# Altium schematic sheet DC-DC.SchDoc
size A4; SPICEModelCacheLJJBMKMV: <root> / <DocumentId>LJJBMKMV</DocumentId> / </root>
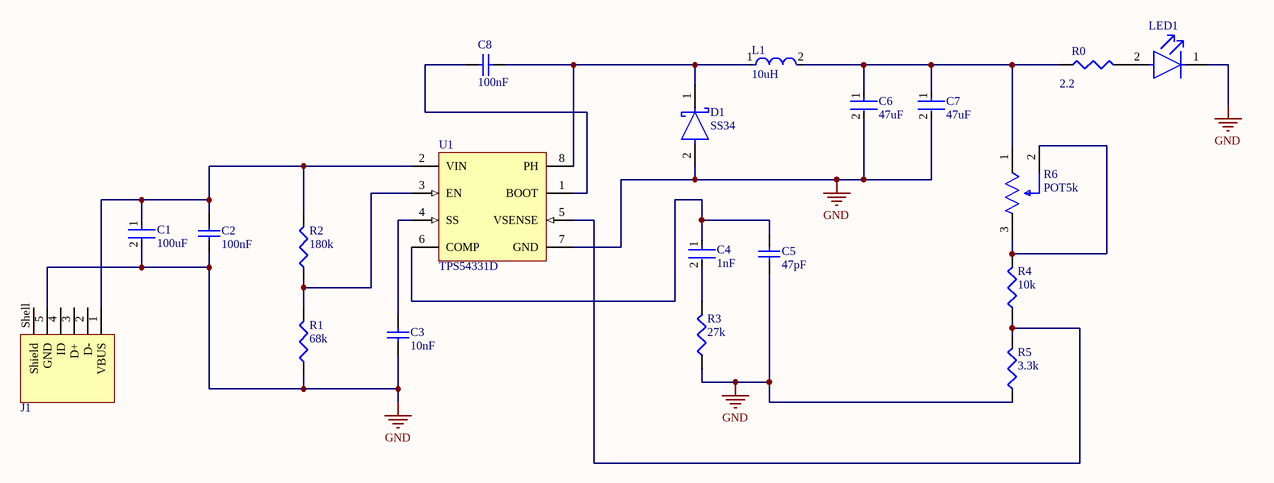
[diagram p0: DC-DC.SchDoc]

## Parts
C1  100uF  [FP-C1210C-FS-MFG]
C2  100nF  [CAPC1608X90X35ML10T15]
C3  10nF  [CAPC1608X90X35ML10T15]
C4  1nF  [FP-0603-L_1_6_0_15-W_0_81-IPC_A]
C5  47pF  [CAPC1608X90X35ML10T15]
C6  47uF  [FP-GRM32E-0_3-0_2-IPC_A]
C7  47uF  [FP-GRM32E-0_3-0_2-IPC_A]
C8  100nF  [CAPC1608X90X35ML10T15]
D1  SS34  [FP-95402-MFG]
J1  (no value)  [651305142821]
L1  10uH  [FP-LQH32CH_23-MFG]
LED1  (no value)  [FP-LB_Q39G-MFG]
R0  2.2  [J1-0603]
R1  68k  [J1-0603]
R2  180k  [J1-0603]
R3  27k  [J1-0603]
R4  10k  [J1-0603]
R5  3.3k  [J1-0603]
R6  POT5k  [FP-3224W-MFG]
U1  TPS54331D  [D0008A_L]

## Nets
GND: C1.2 C2.1 C3.1 C5.1 C6.2 C7.2 D1.2(A) J1.5(GND) LED1.1(C) R1.1 R3.1 R5.1 U1.7(GND)
NetC1_1: C1.1 C2.2 J1.1(VBUS) R2.2 U1.2(VIN)
NetC3_2: C3.2 U1.4(SS)
NetC4_1: C4.1 C5.2 U1.6(COMP)
NetC4_2: C4.2 R3.2
NetC6_1: C6.1 C7.1 L1.2 R0.1 R6.1(CCW)
NetC8_1: C8.1 U1.1(BOOT)
NetC8_2: C8.2 D1.1(C) L1.1 U1.8(PH)
NetLED1_2: LED1.2(A) R0.2
NetR1_2: R1.2 R2.1 U1.3(EN)
NetR4_1: R4.1 R5.2 U1.5(VSENSE)
NetR4_2: R4.2 R6.2(WIPER) R6.3(CW)

Not connected (* = marked no-connect by the designer): J1 2(D-) 3(D+) 4(ID) Shell(Shield)

## Library data of the parts
C1 = CMP-03020-034653-1: CAP CER 100UF 16V X5R 1210; Tolerance: 20%; Dielectric Material: Ceramic; Max Operating Temperature: 85°C; REACH SVHC: No SVHC; Case Code (Metric): 3225; Case/Package: 1210; Thickness: 0.106inch; Length: 3.2mm; Min Operating Temperature: -55°C; Voltage Rating (DC): 16V; Weight: 0.000564oz; Packaging: Tape and Reel; Case Code (Imperial): 1210; Depth: 2.5mm; Lead Free: Lead Free; Width: 0.098inch; Voltage Rating: 16V; Capacitance: 100uF; Termination: SMD/SMT; Dielectric: X5R; Package Quantity: 1000
C2 C8 = CMP-2100-03643-1: Chip Capacitor, 0.1 uF, +/- 10%, 50 V, -55 to 125 degC, 0603 (1608 Metric), RoHS, Tape and Reel; Manufacturer: Murata; Dielectric Material: Ceramic; Voltage Rating: 50V; Dielectric: X7R; Insulation Resistance: 10GR; Case Code (Metric): 1608; Lead Free: LeadFree; Depth: 0.8mm; Number of Pins: 2; Radiation Hardening: No; Case/Package: 0603; Manufacturer URL: http://www.murata.com/; Packaging: TapeandReel; Length: 1.6mm; Contact Plating: Tin; Datasheet URL: http://psearch.en.murata.com/capacitor/product/GRM188R71H104KA93%23.pdf; Tolerance: 10%; Case Code (Imperial): 0603; Min Operating Temperature: -55degC; RoHSCompliant: true; Capacitance: 100nF; Voltage: 50V; Termination: SMD/SMT; Mount: SurfaceMount; Material: Ceramic; Package Quantity: 1; Height: 0.8mm; Thickness: 0.035inch; REACH SVHC: NoSVHC; Max Operating Temperature: 125degC; Width: 0.8mm; Package Reference: 0603; Voltage Rating (DC): 50V; Datasheet Version: 42675.0; Package Description: 2-Pin Surface Mount Device, Body 1.6 x 0.8 mm
C3 = CMP-2100-03642-1: Chip Capacitor, 10 nF, +/- 10%, 50 V, -55 to 125 degC, 0603 (1608 Metric), RoHS, Tape and Reel; Manufacturer: Murata; Insulation Resistance: 10GR; Dielectric: X7R; Voltage Rating: 50V; Material: Ceramic; Package Quantity: 1; Lead Free: LeadFree; Case/Package: 0603; Termination: SMD/SMT; REACH SVHC: Unknown; Manufacturer URL: http://www.murata.com/; Datasheet URL: http://search.murata.co.jp/Ceramy/image/img/A01X/G101/ENG/GRM188R71H103KA01-01.pdf; Mount: SurfaceMount; Datasheet Version: 42401.0; Number of Pins: 2; Length: 1.6mm; Voltage: 50V; Depth: 0.8mm; Tolerance: 10%; Min Operating Temperature: -55degC; Voltage Rating (DC): 50V; Max Operating Temperature: 125degC; Package Description: 2-Pin Surface Mount Device, Body 1.6 x 0.8 mm; RoHSCompliant: True; Case Code (Imperial): 0603; Width: 0.031inch; Case Code (Metric): 1608; Height: 0.8mm; Package Reference: 0603; Packaging: TapeandReel; Thickness: 0.035inch; Capacitance: 10nF; Dielectric Material: Ceramic
C4 = CMP-2006-04378-2: General Purpose Ceramic Capacitor, 0603, 1nF, 10%, X7R, 15%, 50V; Case Code (Metric): 1608; Min Operating Temperature: -55°C; Weight: 7.1E-05oz; Series: -; Capacitance: 1nF; RoHS Compliant: Yes; Radiation Hardening: No; Height: 0.9mm; Mount: Surface Mount; REACH SVHC: No SVHC; Lead Free: Lead Free; Depth: 0.81mm; Voltage: 50V; Number of Pins: 2; Voltage Rating: 50V; Max Operating Temperature: 125°C; Termination: SMD/SMT; Construction: Flat; Case Code (Imperial): 0603; Dielectric: X7R; Width: 0.032inch; Tolerance: 10%; Case/Package: 0603; Contact Plating: Tin; Packaging: Tape and Reel; Voltage Rating (DC): 50V; Dielectric Material: Ceramic; Package Quantity: 4000; Thickness: 0.035inch; Length: 1.6mm
C5 = CMP-2006-02672-1: Manufacturer: Murata; Part Number: GRM1885C1H470JA01D
C6 C7 = CMP-06035-000110-2: Chip Multilayer Ceramic Capacitors for General Purpose, 1210, 47uF, X6S, 22%, 10%, 16V; Case Code (Metric): 3225; Packaging: Tape and Reel; Mount: Surface Mount; Material: Ceramic; Voltage: 16V; Dielectric: X6S; Depth: 2.5mm; Min Operating Temperature: -55°C; Width: 2.5mm; Height: 2.5mm; Voltage Rating: 16V; Weight: 0.00388oz; Case Code (Imperial): 1210; Max Operating Temperature: 105°C; Capacitance: 47uF; Package Quantity: 1000; Case/Package: 1210; Voltage Rating (DC): 16V; Termination: SMD/SMT; Length: 3.2mm; Thickness: 0.106inch; Tolerance: 10%; Lead Free: Lead Free; REACH SVHC: No SVHC
D1 = CMP-02539-000012-1: DIODE SCHOTTKY 40V 3A DO214AB; Manufacturer: Vishay; Manufacturer Part Number: SS34-E3/57T; Max Junction Temp: +150°C; Peak Reverse Current: 0.5mA; Max Surge Forward Current: 100A; Standoff Height: 0mm; ComponentLink2Description: Datasheet; Device Class L3: Schottky Diodes; Height: 2.62mm; Max Repetitive Reverse Voltage: 40V; Lead Free: Yes; Package: 95402; Temperature Range High: +150°C; ComponentLink2URL: http://www.vishay.com/docs/88751/ss32.pdf; Temperature: -55°C to +150°C; Footprint Url: http://www.vishay.com/docs/95402/smc.pdf; Automotive: No; Forward Current: 3A; Category: Diode; RoHS: TRUE; Device Class L2: Diodes; Mouser Description: Schottky Diodes & Rectifiers 3.0 Amp 40 Volt; Octopart: https://octopart.com/ss34-e3%2F57t-vishay-39552907; Temperature Range Low: -55°C; Device Class L1: Discrete Semiconductors; Digikey Description: DIODE SCHOTTKY 40V 3A DO214AB
J1 = CMP-1502-03247-2: NexarPartId: 19991175; Operating Supply Voltage: 30V; Current Rating: 1A; Contact Resistance: 20mΩ; Connector Type: USB; Number of Contacts: 5; USB Standard: USB 2.0; Gender: Receptacle; Insulation Resistance: 1GΩ; REACH SVHC: Unknown; Contact Plating: Gold; Min Operating Temperature: -40°C; Features: Shielded; RoHS: Compliant; Contact Material: Copper; Packaging: Tape and Reel; Termination: SMD/SMT; Max Operating Temperature: 105°C; Orientation: Horizontal; Number of Pins: 5; Mount: Horizontal, Surface Mount; Lead Free: Lead Free
L1 = CMP-2000-06582-4: Wire Wound Ferrite Inductor for Power Lines 10μH ±10% 0.572Ω 300mA 1210; Frequency: 26MHz; Shielding: Unshielded; Test Frequency: 1MHz; DC Resistance (DCR): 572mR; Case/Package: 1210; Case Code (Imperial): 1210; Length: 3.2mm; Military Standard: Not; Width: 2.5mm; Depth: 2.7mm; Resistor Type: Wirewound; Mount: Surface Mount; RoHS Compliant: Yes; Package Quantity: 2000; Height: 2mm; Radiation Hardening: No; Height - Seated (Max): 0.067inch; Self Resonant Frequency: 26MHz; Min Operating Temperature: -25°C; Max DC Current: 300mA; Rated Current-Max: 300mA; Series: LQH32C_23; Termination: SMD/SMT; Lead Free: Lead Free; Max Operating Temperature: 85°C; Inductance: 10uH; DC Current: 300mA; Core Material: Ferrite; Current Rating: 300mA; Case Code (Metric): 3225; Packaging: Tape and Reel; Weight: 0.002116oz; Tolerance: 10%
LED1 = CMP-62016-000036-2: LED BLUE DIFFUSED 0603 SMD; Test Current: 5mA; Dominant Wavelength: 470nm; Number of LEDs: 1; Luminous Flux: 0.07lm; Viewing Angle: 135°; Lens Size: 0.8mm; Luminous Intensity: 29.5mcd; Lens Color: White; Lens Style: Flat; Forward Voltage: 2.85V; Lens Transparency: Diffused; Packaging: Tape and Reel; Case/Package: 0603; Series: CHIPLED 0603; Color: Blue; Height: 0.4mm; Mount: Surface Mount; Length: 1.6mm; Radiation Hardening: No; Case Code (Metric): 1608; Width: 0.8mm; Case Code (Imperial): 0603; Number of Pins: 2
R0-R5 = Res3: Resistor; Published: 8-Jun-2000; LatestRevisionDate: 29-May-2009; LatestRevisionNote: IPC-7351 Footprint Added.; PackageReference: J1-0603; Publisher: Altium Limited; PackageDescription: Chip Resistor
R6 = CMP-2000-05077-2: TRIMMER 10K OHM 0.25W J LEAD TOP; Manufacturer: Bourns; Manufacturer Part Number: 3224W-1-103E; Tolerance: 10%; Resistance: 10kΩ; Temperature Coefficient: 100ppm/°C; Value: 10kΩ; Standoff Height: 0.2mm; Voltage Rating: 300V; Power Rating: 250mW; Device Class L3: Variable Resistors and Potentiometers; Composition: Cermet; Temperature Range Low: -65°C; Package: 3224W; ComponentLink2Description: Datasheet; Digikey Description: TRIMMER 10K OHM 0.25W J LEAD TOP; Category: Res; Mouser Description: Trimmer Resistors - SMD 4mm 10Kohms 10% Square Cermet Sealed; Temperature: -65°C to +150°C; Device Class L2: Resistors; Device Class L1: Passive Components; RoHS: TRUE; Temperature Range High: +150°C; ComponentLink2URL: https://upverter.com/datasheet/a166fca85da25564670351d2dc712345c058bc40.pdf; Series: 3224; Height: 5.55mm; Lead Free: Yes; Octopart: https://octopart.com/3224w-1-103e-bourns-14818; Automotive: No
U1 = CMP-0323-00203-3: Buck Step Down Regulator with 3.5 to 28 V Input and 0.8 to 25 V Output, -40 to 150 degC, 8-Pin SOIC (D), Green (RoHS & no Sb/Br); Manufacturer: Texas Instruments; Regulated Outputs(#): 1; Vout(Min)(V): 0.8; Iout(Max)(A): 3; Vin(Min)(V): 3.5; Rating: Catalog; SubFamily: Step-Down Regulator; Vout(Max)(V): 25; Iq(Typ)(mA): 0.11; Vin(Max)(V): 28; Duty Cycle(Max)(%): 90; ComponentLink3Description: URL Link1; ComponentLink1URL: http://www.ti.com/general/docs/lit/getliterature.tsp?genericPartNumber=TPS54331&fileType=pdf; Code_JEDEC: MS-012AA; PartNumber: TPS54331D; PackageVersion: revM, Jun-2011; ComponentLink1Description: Datasheet; PackageReference: D0008A; Eco-Plan: Green (RoHS & no Sb/Br); PackageDescription: 8-Pin Plastic Small Outline Integrated Circuit, 4.9 x 3.9 mm, Pitch 1.27 mm Pitch; ComponentLink2URL: http://www.ti.com/litv/pdf/msoi002j; DatasheetVersion: SLVS839D; Topology: Buck; Switch Current Limit(Typ)(A): 3.5; ComponentLink3URL: Samples URL:http://www.ti.com/product/tps54331#samples; ComponentLink2Description: Package Specification; Mounting Technology: Surface Mount